# EAGLE design Control (EAGLE 9.6.2)
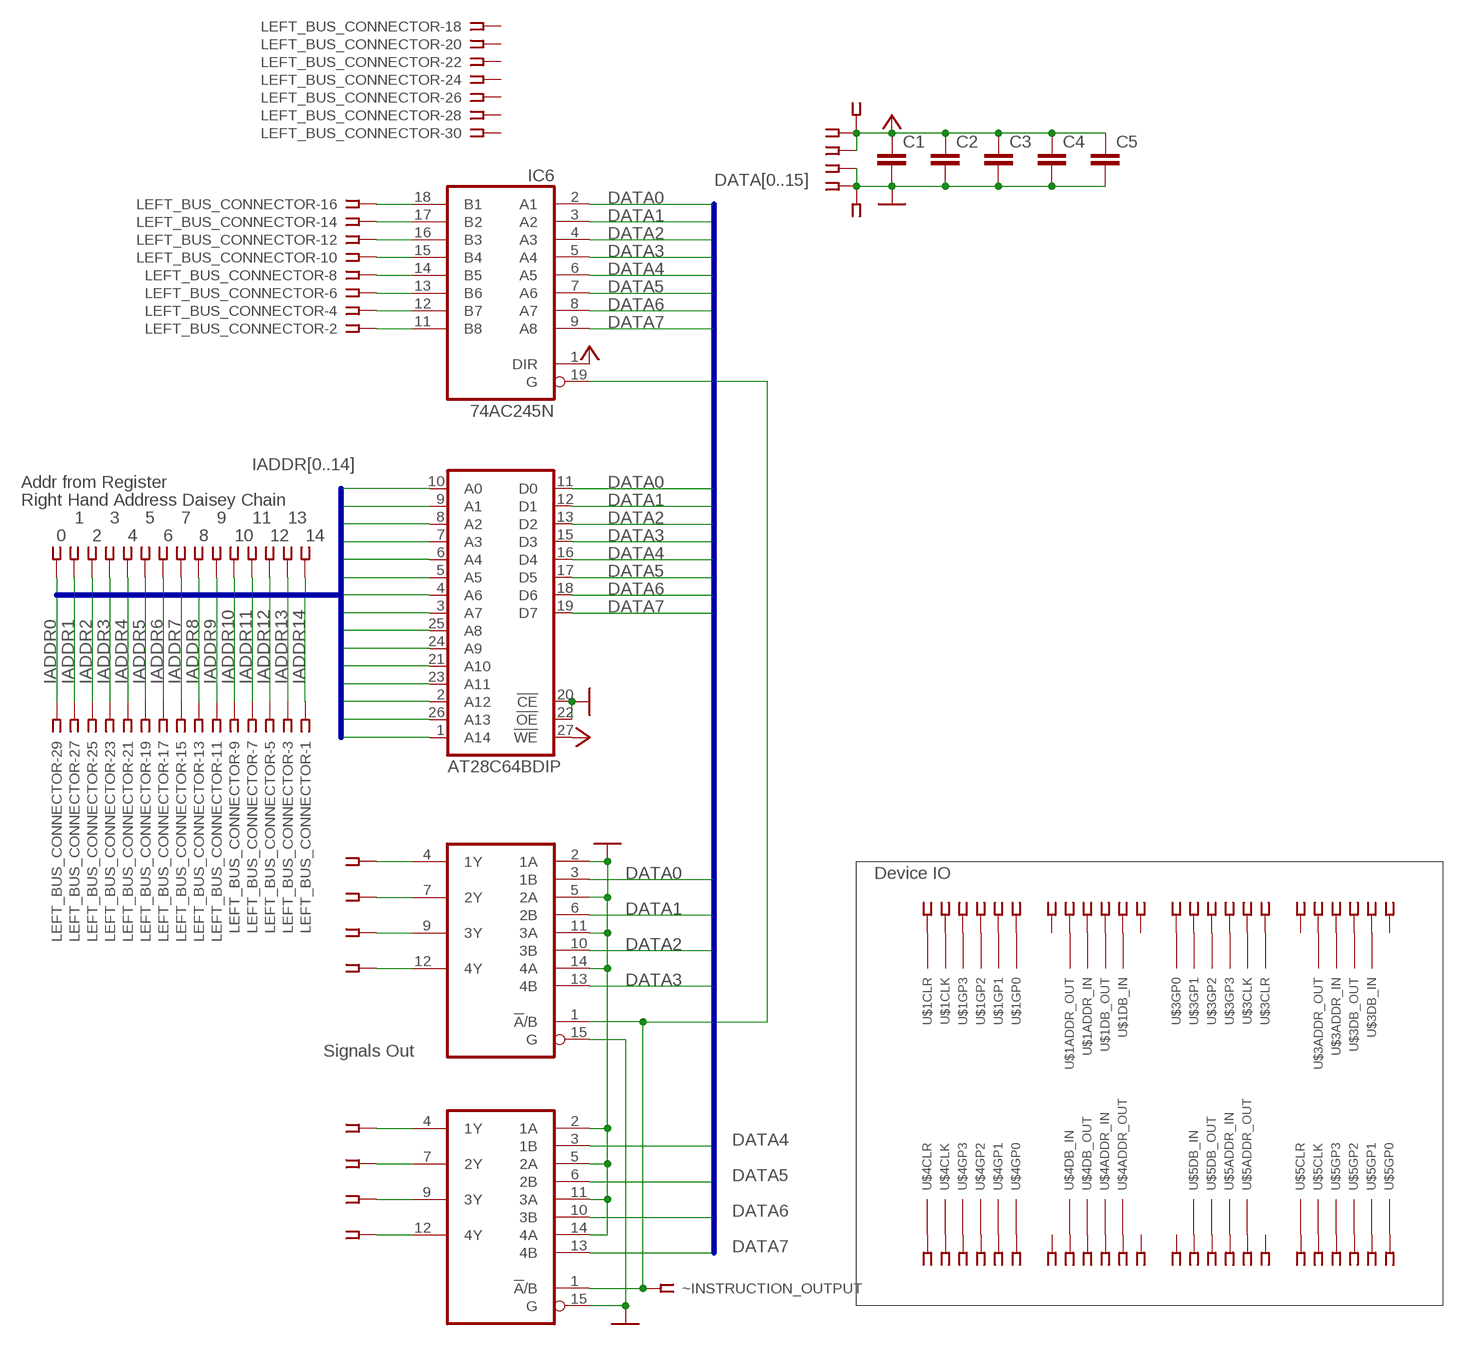
[diagram p0: schematic, sheet 1]

## Parts
C1  C2.5/2  [C2.5-2]
C2  C2.5/2  [C2.5-2]
C3  C2.5/2  [C2.5-2]
C4  C2.5/2  [C2.5-2]
C5  C2.5/2  [C2.5-2]
IC4  74AC157N  [DIL16]
IC5  74AC157N  [DIL16]
IC6  74AC245N  [DIL20]
LEFT_BUS_CONNECTOR  SSW-115-02-G-D  [SSW-115-02-G-D]
MEZZANINE  SSW-104-02-G-S  [SSW-104-02-G-S]
U$1  CONTROL_SIG-INT  [CONTROL_SIG-INT-FOOT]
U$2  AT28C64BDIP  [DIP28-WIDE]
U$3  CONTROL_SIG-INT  [CONTROL_SIG-INT-FOOT]
U$4  CONTROL_SIG-INT  [CONTROL_SIG-INT-FOOT]
U$5  CONTROL_SIG-INT  [CONTROL_SIG-INT-FOOT]
X1  SSW-106-02-G-S  [SSW-106-02-G-S]
X2  SSW-106-02-G-S  [SSW-106-02-G-S]
X3  SSW-106-02-G-S  [SSW-106-02-G-S]
X4  SSW-106-02-G-S  [SSW-106-02-G-S]
X5  SSW-108-02-G-S  [SSW-108-02-G-S]
X6  SSW-106-02-G-S  [SSW-106-02-G-S]
X7  SSW-106-02-G-S  [SSW-106-02-G-S]
X8  SSW-106-02-G-S  [SSW-106-02-G-S]
X9  SSW-106-02-G-S  [SSW-106-02-G-S]
X11  SSW-102-02-G-S  [SSW-102-02-G-S]
X12  SSW-115-02-G-S  [SSW-115-02-G-S]
~INSTRUCTION_OUTPUT  SSW-101-02-G-S  [SSW-101-02-G-S]

## Nets
DATA0: IC4.3(1B) IC6.2(A1) U$2.11(D0)
DATA1: IC4.6(2B) IC6.3(A2) U$2.12(D1)
DATA2: IC4.10(3B) IC6.4(A3) U$2.13(D2)
DATA3: IC4.13(4B) IC6.5(A4) U$2.15(D3)
DATA4: IC5.3(1B) IC6.6(A5) U$2.16(D4)
DATA5: IC5.6(2B) IC6.7(A6) U$2.17(D5)
DATA6: IC5.10(3B) IC6.8(A7) U$2.18(D6)
DATA7: IC5.13(4B) IC6.9(A8) U$2.19(D7)
GND: C1.2 C2.2 C3.2 C4.2 C5.2 IC4.2(1A) IC4.5(2A) IC4.11(3A) IC4.14(4A) IC4.15(G) IC5.2(1A) IC5.5(2A) IC5.11(3A) IC5.14(4A) IC5.15(G) MEZZANINE.3 MEZZANINE.4 U$2.20(!CE) U$2.22(!OE) X11.2
I_OUT: IC4.1(!A!/B) IC5.1(!A!/B) IC6.19(G) ~INSTRUCTION_OUTPUT.1
IADDR0: LEFT_BUS_CONNECTOR.29 U$2.10(A0) X12.1
IADDR1: LEFT_BUS_CONNECTOR.27 U$2.9(A1) X12.2
IADDR2: LEFT_BUS_CONNECTOR.25 U$2.8(A2) X12.3
IADDR3: LEFT_BUS_CONNECTOR.23 U$2.7(A3) X12.4
IADDR4: LEFT_BUS_CONNECTOR.21 U$2.6(A4) X12.5
IADDR5: LEFT_BUS_CONNECTOR.19 U$2.5(A5) X12.6
IADDR6: LEFT_BUS_CONNECTOR.17 U$2.4(A6) X12.7
IADDR7: LEFT_BUS_CONNECTOR.15 U$2.3(A7) X12.8
IADDR8: LEFT_BUS_CONNECTOR.13 U$2.25(A8) X12.9
IADDR9: LEFT_BUS_CONNECTOR.11 U$2.24(A9) X12.10
IADDR10: LEFT_BUS_CONNECTOR.9 U$2.21(A10) X12.11
IADDR11: LEFT_BUS_CONNECTOR.7 U$2.23(A11) X12.12
IADDR12: LEFT_BUS_CONNECTOR.5 U$2.2(A12) X12.13
IADDR13: LEFT_BUS_CONNECTOR.3 U$2.26(A13) X12.14
IADDR14: LEFT_BUS_CONNECTOR.1 U$2.1(A14) X12.15
N$1: U$1.GP0 X1.6
N$2: U$1.GP1 X1.5
N$3: U$1.GP2 X1.4
N$4: U$1.GP3 X1.3
N$5: U$1.CLK X1.2
N$6: U$1.CLR X1.1
N$7: U$1.DB_IN X2.2
N$8: U$1.DB_OUT X2.3
N$9: U$1.ADDR_IN X2.4
N$10: U$1.ADDR_OT X2.5
N$11: U$3.GP0 X3.6
N$12: U$3.GP1 X3.5
N$13: U$3.GP2 X3.4
N$14: U$3.GP3 X3.3
N$15: U$3.CLK X3.2
N$16: U$3.CLR X3.1
N$17: U$3.DB_IN X4.2
N$18: U$3.DB_OUT X4.3
N$19: U$3.ADDR_IN X4.4
N$20: U$3.ADDR_OT X4.5
N$21: U$4.CLR X9.1
N$22: U$4.CLK X9.2
N$23: U$4.GP0 X9.6
N$24: U$4.GP1 X9.5
N$25: U$4.GP2 X9.4
N$26: U$4.GP3 X9.3
N$27: U$4.DB_IN X8.2
N$28: U$4.DB_OUT X8.3
N$29: U$4.ADDR_IN X8.4
N$30: U$4.ADDR_OT X8.5
N$31: U$5.GP0 X6.6
N$32: U$5.GP3 X6.3
N$33: U$5.GP2 X6.4
N$34: U$5.GP1 X6.5
N$35: U$5.CLK X6.2
N$36: U$5.CLR X6.1
N$37: U$5.DB_IN X7.2
N$38: U$5.DB_OUT X7.3
N$39: U$5.ADDR_IN X7.4
N$40: U$5.ADDR_OT X7.5
O_DB0: IC6.18(B1) LEFT_BUS_CONNECTOR.16
O_DB1: IC6.17(B2) LEFT_BUS_CONNECTOR.14
O_DB2: IC6.16(B3) LEFT_BUS_CONNECTOR.12
O_DB3: IC6.15(B4) LEFT_BUS_CONNECTOR.10
O_DB4: IC6.14(B5) LEFT_BUS_CONNECTOR.8
O_DB5: IC6.13(B6) LEFT_BUS_CONNECTOR.6
O_DB6: IC6.12(B7) LEFT_BUS_CONNECTOR.4
O_DB7: IC6.11(B8) LEFT_BUS_CONNECTOR.2
SIG_1: IC4.4(1Y) X5.1
SIG_2: IC4.7(2Y) X5.2
SIG_3: IC4.9(3Y) X5.3
SIG_4: IC4.12(4Y) X5.4
SIG_5: IC5.4(1Y) X5.5
SIG_6: IC5.7(2Y) X5.6
SIG_7: IC5.9(3Y) X5.7
SIG_8: IC5.12(4Y) X5.8
VCC: C1.1 C2.1 C3.1 C4.1 C5.1 IC6.1(DIR) MEZZANINE.1 MEZZANINE.2 U$2.27(!WE) X11.1
Unconnected: LEFT_BUS_CONNECTOR.18 LEFT_BUS_CONNECTOR.20 LEFT_BUS_CONNECTOR.22 LEFT_BUS_CONNECTOR.24 LEFT_BUS_CONNECTOR.26 LEFT_BUS_CONNECTOR.28 LEFT_BUS_CONNECTOR.30 X2.1 X2.6 X4.1 X4.6 X7.1 X7.6 X8.1 X8.6

## Buses
IADDR[0..14]
DATA[0..15]

## Notes on the sheet
- Addr from Register
- Right Hand Address Daisey Chain
- 1 | 3 | 5 | 7 | 9 | 11 | 13
- 0 | 2 | 4 | 6 | 8 | 10 | 12 | 14
- Device IO
- Signals Out

## Power pins joined to a net without a drawn wire
GND: IC4.8(GND) IC5.8(GND) IC6.10(GND) U$1.GND U$2.14(GND) U$3.GND U$4.GND U$5.GND
VCC: IC4.16(VCC) IC5.16(VCC) IC6.20(VCC) U$1.VCC U$2.28(VCC) U$3.VCC U$4.VCC U$5.VCC

## Library data of the parts
C1-C5 = capacitor-wima:C: CAPACITOR naming: grid - package width
IC4 IC5 = 74xx-eu:74*157: Quadruple 2-line to 1-line data SELECTOR/MULTIPLEXER
IC6 = 74xx-eu:74*245: Octal BUS TRANSCEIVER, 3-state
LEFT_BUS_CONNECTOR = con-samtec:SSW-115-02-G: THROUGH-HOLE .025" SQ POST SOCKET Source: Samtec SSW.pdf; MF: Samtec Inc.; MPN: SSW-115-02-G-D; OC_FARNELL: unknown; OC_NEWARK: 11P9563
MEZZANINE = con-samtec:SSW-104-02-G-S: THROUGH-HOLE .025" SQ POST SOCKET Source: Samtec SSW.pdf; MF: Samtec Inc.; MPN: SSW-104-02-G-S; OC_FARNELL: unknown; OC_NEWARK: 11P9384
U$1 U$3-U$5 = Computer:CONTROL_SIG-INT
U$2 = Computer:AT28C64B
X1-X4 X6-X9 = con-samtec:SSW-106-02-G-S: THROUGH-HOLE .025" SQ POST SOCKET Source: Samtec SSW.pdf; MF: Samtec Inc.; MPN: SSW-106-02-G-S; OC_FARNELL: unknown; OC_NEWARK: 11P9416
X5 = con-samtec:SSW-108-02-G-S: THROUGH-HOLE .025" SQ POST SOCKET Source: Samtec SSW.pdf; MF: Samtec Inc.; MPN: SSW-108-02-G-S; OC_FARNELL: unknown; OC_NEWARK: 11P9448
X11 = con-samtec:SSW-102-02-G-S: THROUGH-HOLE .025" SQ POST SOCKET Source: Samtec SSW.pdf; MF: Samtec Inc.; MPN: SSW-102-02-G-S; OC_FARNELL: unknown; OC_NEWARK: 11P9351
X12 = con-samtec:SSW-115-02-G-S: THROUGH-HOLE .025" SQ POST SOCKET Source: Samtec SSW.pdf; MF: Samtec Inc.; MPN: SSW-115-02-G-S; OC_FARNELL: unknown; OC_NEWARK: 11P9564
~INSTRUCTION_OUTPUT = con-samtec:SSW-101-02-G-S: THROUGH-HOLE .025" SQ POST SOCKET Source: Samtec SSW.pdf; MF: Samtec Inc.; MPN: SSW-101-02-G-S; OC_FARNELL: unknown; OC_NEWARK: 11P9336

## Board
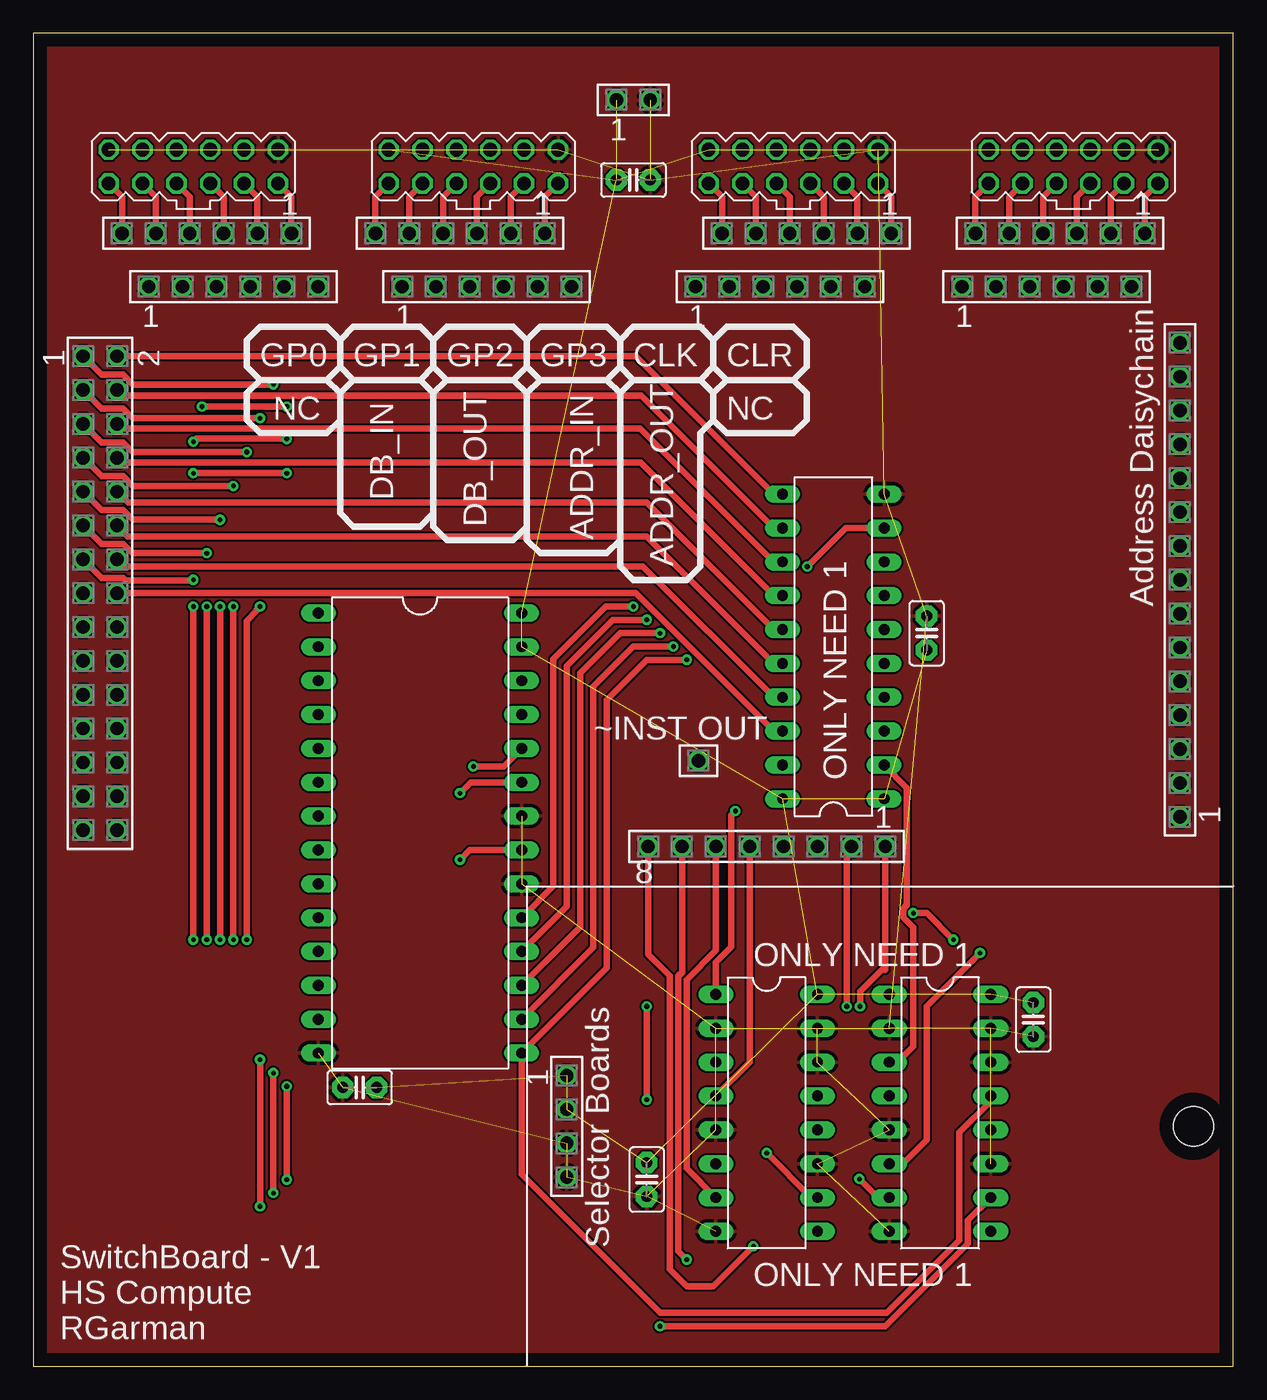
[diagram p1: board, top side]
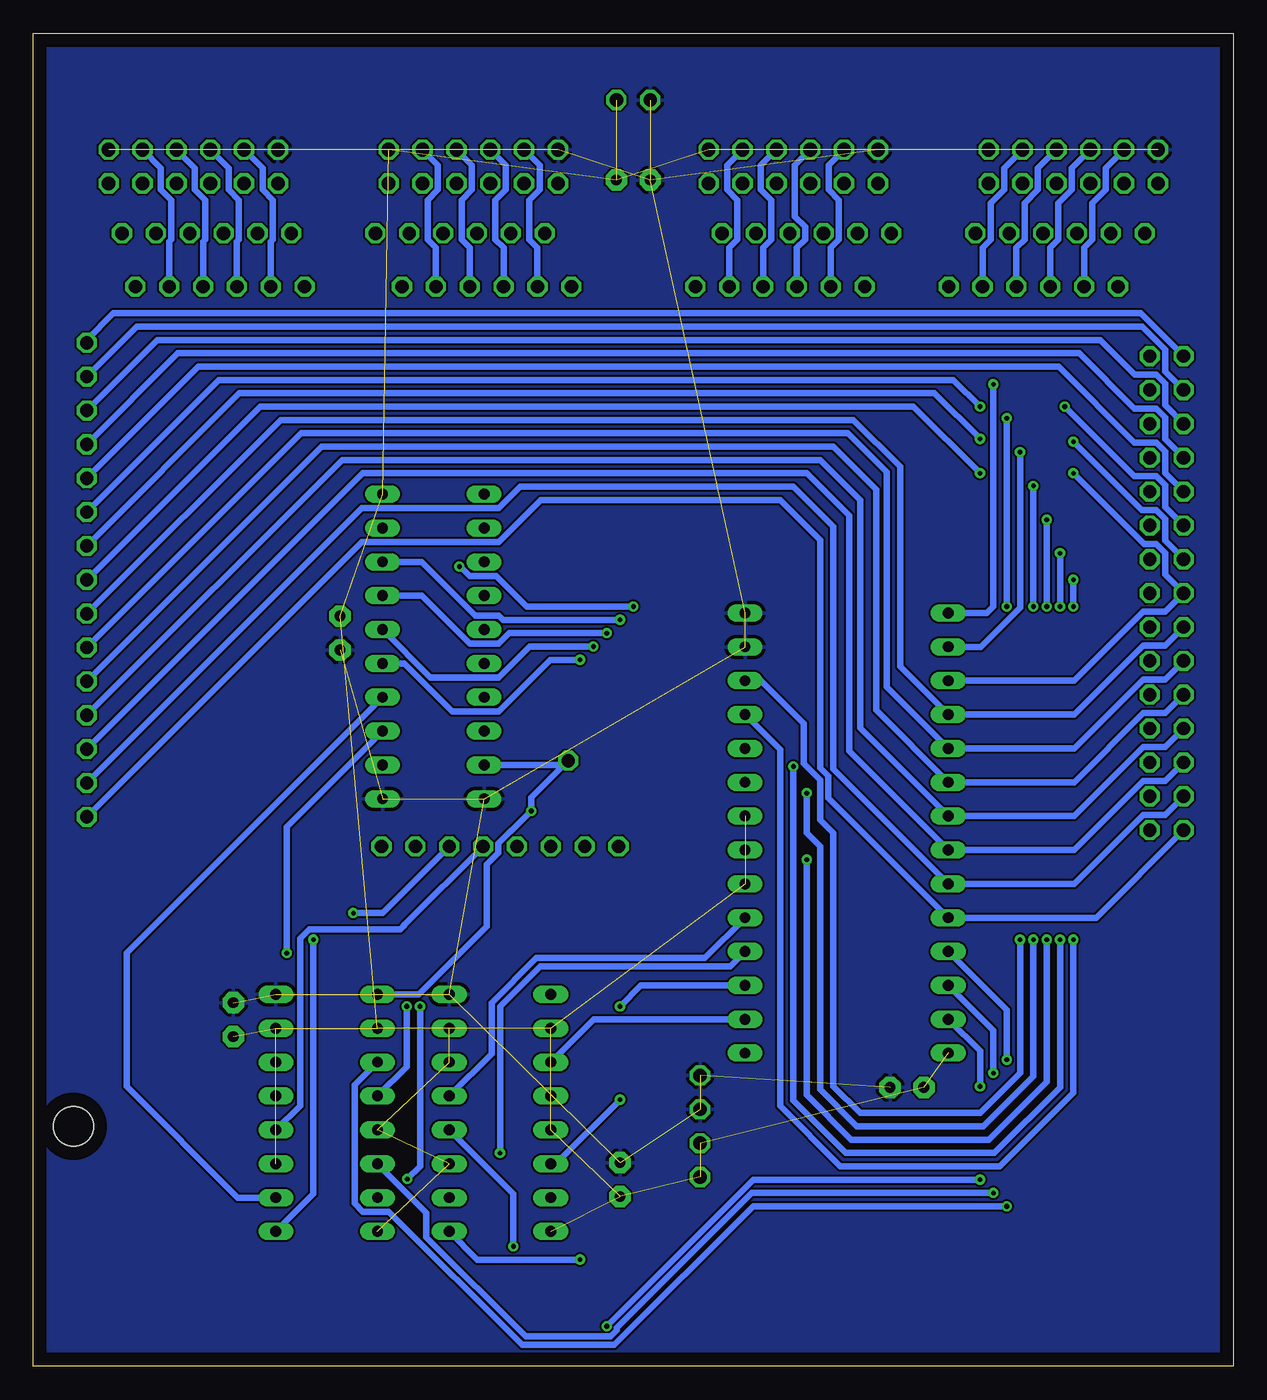
[diagram p2: board, bottom side, seen from below]

Size 90 x 100 mm. Coordinates in mm from the lower left corner, seen from the top.
Outline: 0,0 90,0 90,100 0,100 0,0
Copper layers (1*16): Top 0.035mm / dielectric 1.5mm / Bottom 0.035mm
Design rules "default *": minimum track width 19mil, minimum drill 0.35mm, track to track 6mil, track to pad 6mil, pad to pad 6mil, via to via 6mil, smd to smd 6mil, copper to edge 40mil, drill to drill 6mil, minimum pad ring 10mil, minimum via ring 8mil, stop-mask expansion 4mil, vias tented up to drill 0mil, thermal gap 10mil
Holes 3 mm at 87,18

### Footprints (pad centres in the part's own frame; a part is rotated, then mirrored left to right if it is on the bottom)
C2.5-2 = drill 0.813 pad 1.6 octagon: 1 -1.27,0; 2 1.27,0
DIL16 = drill 0.813 long: 1 -8.89,-3.81; 2 -6.35,-3.81; 3 -3.81,-3.81; 4 -1.27,-3.81; 5 1.27,-3.81; 6 3.81,-3.81; 7 6.35,-3.81; 8 8.89,-3.81; 9 8.89,3.81; 10 6.35,3.81; 11 3.81,3.81; 12 1.27,3.81; 13 -1.27,3.81; 14 -3.81,3.81; 15 -6.35,3.81; 16 -8.89,3.81
DIL20 = drill 0.813 long: 1 -11.43,-3.81; 2 -8.89,-3.81; 3 -6.35,-3.81; 4 -3.81,-3.81; 5 -1.27,-3.81; 6 1.27,-3.81; 7 3.81,-3.81; 8 6.35,-3.81; 9 8.89,-3.81; 10 11.43,-3.81; 11 11.43,3.81; 12 8.89,3.81; 13 6.35,3.81; 14 3.81,3.81; 15 1.27,3.81; 16 -1.27,3.81; 17 -3.81,3.81; 18 -6.35,3.81; 19 -8.89,3.81; 20 -11.43,3.81
SSW-115-02-G-D = drill 1 pad 1.5 octagon: 1 -17.78,-1.27; 2 -17.78,1.27; 3 -15.24,-1.27; 4 -15.24,1.27; 5 -12.7,-1.27; 6 -12.7,1.27; 7 -10.16,-1.27; 8 -10.16,1.27; 9 -7.62,-1.27; 10 -7.62,1.27; 11 -5.08,-1.27; 12 -5.08,1.27; 13 -2.54,-1.27; 14 -2.54,1.27; 15 0,-1.27; 16 0,1.27; 17 2.54,-1.27; 18 2.54,1.27; 19 5.08,-1.27; 20 5.08,1.27; 21 7.62,-1.27; 22 7.62,1.27; 23 10.16,-1.27; 24 10.16,1.27; 25 12.7,-1.27; 26 12.7,1.27; 27 15.24,-1.27; 28 15.24,1.27; 29 17.78,-1.27; 30 17.78,1.27
SSW-104-02-G-S = drill 1 pad 1.5 octagon: 1 -3.81,0; 2 -1.27,0; 3 1.27,0; 4 3.81,0
CONTROL_SIG-INT-FOOT = drill 1.016 octagon: ADDR_IN 1.27,1.27; ADDR_OT 3.81,1.27; CLK 3.81,-1.27; CLR 6.35,-1.27; DB_IN -3.81,1.27; DB_OUT -1.27,1.27; GND 6.35,1.27; GP0 -6.35,-1.27; GP1 -3.81,-1.27; GP2 -1.27,-1.27; GP3 1.27,-1.27; VCC -6.35,1.27
DIP28-WIDE = drill 0.813 long: 1 -16.51,-7.62; 2 -13.97,-7.62; 3 -11.43,-7.62; 4 -8.89,-7.62; 5 -6.35,-7.62; 6 -3.81,-7.62; 7 -1.27,-7.62; 8 1.27,-7.62; 9 3.81,-7.62; 10 6.35,-7.62; 11 8.89,-7.62; 12 11.43,-7.62; 13 13.97,-7.62; 14 16.51,-7.62; 15 16.51,7.62; 16 13.97,7.62; 17 11.43,7.62; 18 8.89,7.62; 19 6.35,7.62; 20 3.81,7.62; 21 1.27,7.62; 22 -1.27,7.62; 23 -3.81,7.62; 24 -6.35,7.62; 25 -8.89,7.62; 26 -11.43,7.62; 27 -13.97,7.62; 28 -16.51,7.62
SSW-106-02-G-S = drill 1 pad 1.5 octagon: 1 -6.35,0; 2 -3.81,0; 3 -1.27,0; 4 1.27,0; 5 3.81,0; 6 6.35,0
SSW-108-02-G-S = drill 1 pad 1.5 octagon: 1 -8.89,0; 2 -6.35,0; 3 -3.81,0; 4 -1.27,0; 5 1.27,0; 6 3.81,0; 7 6.35,0; 8 8.89,0
SSW-102-02-G-S = drill 1 pad 1.5 octagon: 1 -1.27,0; 2 1.27,0
SSW-115-02-G-S = drill 1 pad 1.5 octagon: 1 -17.78,0; 2 -15.24,0; 3 -12.7,0; 4 -10.16,0; 5 -7.62,0; 6 -5.08,0; 7 -2.54,0; 8 0,0; 9 2.54,0; 10 5.08,0; 11 7.62,0; 12 10.16,0; 13 12.7,0; 14 15.24,0; 15 17.78,0
SSW-101-02-G-S = drill 1 pad 1.5 octagon: 1 0,0

### Placement (x,y rotation side)
C1  67,55 90 top
C2  24.48,20.91 180 top
C3  45,89 0 top
C4  46,14 270 top
C5  75,26 270 top
IC4  68,19 270 top
IC5  55,19 270 top
IC6  60,54 90 top
LEFT_BUS_CONNECTOR  5,58 270 top
MEZZANINE  40,18 270 top
U$1  12,90 0 top
U$2  29,40 270 top
U$3  33,90 0 top
U$4  78,90 0 top
U$5  57,90 0 top
X1  13,85 180 top
X2  15,81 0 top
X3  32,85 180 top
X4  34,81 0 top
X5  55,39 180 top
X6  58,85 180 top
X7  56,81 0 top
X8  76,81 0 top
X9  77,85 180 top
X11  45,95 0 top
X12  86,59 90 top
~INSTRUCTION_OUTPUT  49.88,45.43 0 top

### Tracks (layer width: path | path; a pad name or v marks a point on that pad's centre or on a via)
DATA0  (via drill 0.35)
  Top 0.483: v17,23 v17,12 | IC6.2 65.53,43.4 65.53,34.62 65.23,34.32 65.23,33.68 66,32.91 66,24 64.81,22.81 IC4.3
  Bottom 0.483: U$2.11 17,26.73 v17,23 | v17,12 36.01,12 46.42,1.59 53.34,1.59 63.34,11.6 65.29,11.6 65.9,12.21 65.9,21.1 IC4.3
DATA1  (via drill 0.35)
  Top 0.483: v18,22 v18,13 | v71,31 67,27 67,17 65.19,15.19 IC4.6
  Bottom 0.483: U$2.12 18,25.19 v18,22 | IC4.6 60.52,11.52 60.52,9.67 53.08,2.23 46.68,2.23 46.23,2.68 46.23,2.87 36.1,13 v18,13 | IC6.3 71,40.46 v71,31
DATA2  (via drill 0.35)
  Top 0.483: v19,21 v19,14 | IC4.10 70.1,10.94 70.1,9.2 63.9,3 v47,3
  Bottom 0.483: U$2.13 19,23.65 v19,21 | v19,14 36,14 v47,3 | IC6.4 83,31 83,21 74.65,12.65 IC4.10
DATA3  (via drill 0.35)
  Top 0.483: IC4.13 71.81,19.88 69.46,17.53 69.46,9.46 64,4 47,4 36.62,14.38 U$2.15 43,29.87 43,50 46,53 v49,53
  Bottom 0.483: v49,53 51.23,53 55.09,49.14 58.57,49.14 62.17,52.73 IC6.5
DATA4  (via drill 0.35)
  Top 0.483: U$2.16 42,31.41 42,51 45,54 v48,54
  Bottom 0.483: IC5.3 47.97,26.03 U$2.16 | v48,54 52.77,54 55.09,51.68 60.22,51.68 IC6.6
DATA5  (via drill 0.35)
  Top 0.483: v46,20 v46,27 | U$2.17 41,32.95 41,52 44,55 v47,55
  Bottom 0.483: IC5.6 50.81,15.19 v46,20 | v46,27 44.43,28.57 U$2.17 | v47,55 54.31,55 55.09,54.22 57.29,54.22 60.88,57.81 IC6.7
DATA6  (via drill 0.35)
  Top 0.483: v55,16 58.35,12.65 IC5.10 | U$2.18 40,34.49 40,52.53 43.47,56 v46,56
  Bottom 0.483: U$2.18 37.73,30 52,30 55,27 v55,16 | IC6.8 60.88,60.35 56.85,56.32 55.09,56.32 54.77,56 v46,56
DATA7  (via drill 0.35)
  Top 0.483: U$2.19 39,36.03 39,53.07 42.93,57 v45,57 | v58.04,60 60.93,62.89 IC6.9
  Bottom 0.483: U$2.19 39.63,30.64 52.26,30.64 55.63,27.26 55.63,23.45 IC5.13 | v58.04,60 57.99,60 57.29,59.3 55.3,59.3 53,57 v45,57
GND  (27 unrouted)
  pour Top: 0,100 90,100 90,0 0,0
I_OUT  (via drill 0.35)
  Top 0.483: IC5.1 51.19,30.29 52.34,31.44 52.34,41.34 v52.66,41.66
  Bottom 0.483: IC4.1 61.11,27.89 56,33 56,37.65 55.12,38.52 55.12,39.23 54.2,40.15 54.16,40.15 v52.66,41.66 52.66,42.66 ~INSTRUCTION_OUTPUT.1 50.2,45.11 IC6.19
IADDR0
  Bottom 0.483: LEFT_BUS_CONNECTOR.29 10.3,33.65 U$2.10 30.36,42.63 30.36,44.26 31,44.9 31,62 34,65 51.93,65 55.09,61.84 65.38,61.84 X12.1
IADDR1
  Bottom 0.483: LEFT_BUS_CONNECTOR.27 5.12,41.37 6.75,41.37 11.92,36.19 U$2.9 30,44.81 30,63 33,66 53.47,66 55.09,64.38 65.38,64.38 X12.2
IADDR2
  Bottom 0.483: LEFT_BUS_CONNECTOR.25 5.12,43.91 6.75,43.91 11.92,38.73 U$2.8 28.82,46.17 28.82,63.83 32,67 65.3,67 X12.3
IADDR3
  Bottom 0.483: LEFT_BUS_CONNECTOR.23 5.12,46.45 6.75,46.45 11.92,41.27 U$2.7 28,47.89 28,65 31,68 66.84,68 X12.4
IADDR4
  Bottom 0.483: LEFT_BUS_CONNECTOR.21 5.12,48.99 6.75,48.99 11.92,43.81 U$2.6 26.79,49.22 26.79,65.78 30,69 68.38,69 X12.5
IADDR5
  Bottom 0.483: LEFT_BUS_CONNECTOR.19 5.12,51.53 6.75,51.53 11.92,46.35 U$2.5 26,50.97 26,67.07 28.93,70 69.92,70 X12.6
IADDR6
  Bottom 0.483: LEFT_BUS_CONNECTOR.17 5.12,54.07 6.75,54.07 11.92,48.89 U$2.4 25,52.51 25,67.48 28.52,71 71.46,71 X12.7
IADDR7  (via drill 0.35)
  Top 0.483: v12,67 v19,67
  Bottom 0.483: U$2.3 11.92,51.43 6.75,56.61 5.12,56.61 LEFT_BUS_CONNECTOR.15 5.12,59.39 5.12,61.02 5.79,61.69 6.69,61.69 v12,67 | v19,67 24,72 73,72 X12.8
IADDR8  (via drill 0.35)
  Top 0.483: LEFT_BUS_CONNECTOR.13 5.12,59.15 6.75,59.15 6.94,58.95 11.95,58.95 v12,59 | v12,69.35 12.22,69.58 v19,69.58 | v12,32 v12,57
  Bottom 0.483: U$2.25 34,46.27 34,19.52 29.48,15 17.52,15 12,20.52 v12,32 | v12,57 v12,59 | LEFT_BUS_CONNECTOR.13 5.12,61.93 5.12,63.55 5.79,64.23 6.87,64.23 v12,69.35 | v19,69.58 22.42,73 74.54,73 X12.9
IADDR9  (via drill 0.35)
  Top 0.483: v13,32 v13,57 | U$2.24 35.27,45 v33,45 | v13,61 7.43,61 6.75,61.69 5.12,61.69 LEFT_BUS_CONNECTOR.11 | v12.65,72 v19,72
  Bottom 0.483: v13,32 13,20.93 17.93,16 29.07,16 33,19.93 v33,45 | v13,57 v13,61 | LEFT_BUS_CONNECTOR.11 5.12,64.47 5.12,66.09 5.79,66.77 7.42,66.77 v12.65,72 | v19,72 21,74 76.08,74 X12.10
IADDR10  (via drill 0.35)
  Top 0.483: U$2.21 32.73,38.73 v32,38 | v14,32 v14,57 | LEFT_BUS_CONNECTOR.9 5.12,64.23 6.75,64.23 7.47,63.5 v14,63.5
  Bottom 0.483: v14,32 14,21.34 18.34,17 28.66,17 32,20.34 v32,38 | LEFT_BUS_CONNECTOR.9 5.12,67.01 5.12,68.64 5.79,69.31 7.42,69.31 13.11,75 77.62,75 X12.11 | v14,57 v14,63.5
IADDR11  (via drill 0.35)
  Top 0.483: v15,32 v15,57 | U$2.23 32.81,43.81 v32,43 | v15,66.04 7.47,66.04 6.75,66.77 5.12,66.77 LEFT_BUS_CONNECTOR.7
  Bottom 0.483: v15,32 15,21.76 18.76,18 28.24,18 31,20.76 31,39 32,40 v32,43 | v15,57 v15,66.04 | LEFT_BUS_CONNECTOR.7 5.12,69.55 5.12,71.17 5.79,71.85 7.42,71.85 11.57,76 40,76 40.47,76 79.16,76 X12.12
IADDR12  (via drill 0.35)
  Top 0.483: LEFT_BUS_CONNECTOR.5 5.12,69.31 6.75,69.31 7.47,68.58 v16,68.58
  Bottom 0.483: U$2.2 18.94,53.97 16,56.91 v16,68.58 | LEFT_BUS_CONNECTOR.5 5.12,72.09 5.12,73.72 5.79,74.39 7.39,74.39 10,77 80.7,77 X12.13
IADDR13  (via drill 0.35)
  Top 0.483: v17,57 16.77,56.77 16.77,56.68 16,55.91 v16,32 | v17,71.12 7.47,71.12 6.75,71.85 5.12,71.85 LEFT_BUS_CONNECTOR.3
  Bottom 0.483: U$2.26 35.43,51.43 32.23,48.23 32.23,45.23 31,44 31,41 30,40 30,21 28,19 19,19 16,22 v16,32 | X12.14 82.26,77.98 6.85,77.98 5.12,76.25 5.12,74.63 LEFT_BUS_CONNECTOR.3 | v17,57 v17,71.12
IADDR14  (via drill 0.35)
  Top 0.483: LEFT_BUS_CONNECTOR.1 5.12,74.39 6.75,74.39 7.47,73.66 v18,73.66
  Bottom 0.483: U$2.1 18.49,56.51 18,57 v18,73.66 | LEFT_BUS_CONNECTOR.1 6.95,79 84,79 86,77 X12.15
N$1
  Top 0.483: U$1.GP0 6.65,87.73 X1.6
N$2
  Top 0.483: U$1.GP1 9.19,87.73 X1.5
N$3
  Top 0.483: U$1.GP2 11.73,87.73 X1.4
N$4
  Top 0.483: U$1.GP3 14.27,87.73 X1.3
N$5
  Top 0.483: U$1.CLK 16.81,87.73 X1.2
N$6
  Top 0.483: U$1.CLR 19.35,87.73 X1.1
N$7
  Bottom 0.483: X2.2 11.19,83.92 10.58,84.53 10.58,87.24 9.57,88.25 9.57,89.89 U$1.DB_IN
N$8
  Bottom 0.483: X2.3 13.73,83.92 13.12,84.53 13.12,87.24 12.11,88.25 12.11,89.89 U$1.DB_OUT
N$9
  Bottom 0.483: X2.4 16.27,83.92 15.66,84.53 15.66,87.24 14.65,88.25 14.65,89.89 U$1.ADDR_IN
N$10
  Bottom 0.483: X2.5 18.81,83.92 18.2,84.53 18.2,87.24 17.19,88.25 17.19,89.89 U$1.ADDR_OT
N$11
  Top 0.483: U$3.GP0 25.65,87.73 X3.6
N$12
  Top 0.483: U$3.GP1 28.19,87.73 X3.5
N$13
  Top 0.483: U$3.GP2 30.73,87.73 X3.4
N$14
  Top 0.483: U$3.GP3 33.27,87.73 X3.3
N$15
  Top 0.483: U$3.CLK 35.81,87.73 X3.2
N$16
  Top 0.483: U$3.CLR 38.35,87.73 X3.1
N$17
  Bottom 0.483: X4.2 30.19,83.92 29.58,84.53 29.58,87.49 30.35,88.25 30.35,90.11 U$3.DB_IN
N$18
  Bottom 0.483: X4.3 32.73,83.92 32.12,84.53 32.12,85.47 32.89,86.24 32.89,90.11 U$3.DB_OUT
N$19
  Bottom 0.483: X4.4 35.27,83.92 34.66,84.53 34.66,87.49 35.43,88.25 35.43,90.11 U$3.ADDR_IN
N$20
  Bottom 0.483: X4.5 37.81,83.92 37.2,84.53 37.2,87.49 37.97,88.25 37.97,90.11 U$3.ADDR_OT
N$21
  Top 0.483: U$4.CLR 83.35,87.73 X9.1
N$22
  Top 0.483: U$4.CLK 80.81,87.73 X9.2
N$23
  Top 0.483: U$4.GP0 70.65,87.73 X9.6
N$24
  Top 0.483: U$4.GP1 73.19,87.73 X9.5
N$25
  Top 0.483: U$4.GP2 75.73,87.73 X9.4
N$26
  Top 0.483: U$4.GP3 78.27,87.73 X9.3
N$27
  Bottom 0.483: X8.2 72.19,84.38 72.04,84.53 72.04,87.49 72.81,88.25 72.81,89.89 U$4.DB_IN
N$28
  Bottom 0.483: X8.3 74.73,84.38 74.58,84.53 74.58,87.49 75.35,88.25 75.35,89.89 U$4.DB_OUT
N$29
  Bottom 0.483: X8.4 77.27,84.38 77.12,84.53 77.12,87.49 77.89,88.25 77.89,89.89 U$4.ADDR_IN
N$30
  Bottom 0.483: X8.5 79.81,84.38 79.66,84.53 79.66,87.49 80.43,88.25 80.43,89.89 U$4.ADDR_OT
N$31
  Top 0.483: U$5.GP0 51.65,87.73 X6.6
N$32
  Top 0.483: U$5.GP3 59.27,87.73 X6.3
N$33
  Top 0.483: U$5.GP2 56.73,87.73 X6.4
N$34
  Top 0.483: U$5.GP1 54.19,87.73 X6.5
N$35
  Top 0.483: U$5.CLK 61.81,87.73 X6.2
N$36
  Top 0.483: U$5.CLR 64.35,87.73 X6.1
N$37
  Bottom 0.483: X7.2 52.19,83.92 52.8,84.53 52.8,87.49 52.03,88.25 52.03,90.11 U$5.DB_IN
N$38
  Bottom 0.483: X7.3 54.73,83.92 55.34,84.53 55.34,87.49 54.57,88.25 54.57,90.11 U$5.DB_OUT
N$39
  Bottom 0.483: X7.4 57.27,83.92 57.88,84.53 57.88,87.49 57.11,88.25 57.11,90.11 U$5.ADDR_IN
N$40
  Bottom 0.483: X7.5 59.81,83.92 60.42,84.53 60.42,87.49 59.65,88.25 59.65,90.11 U$5.ADDR_OT
O_DB0
  Top 0.483: LEFT_BUS_CONNECTOR.16 45.18,58 55.53,47.65 IC6.18
O_DB1
  Top 0.483: LEFT_BUS_CONNECTOR.14 6.81,60 45.72,60 55.53,50.19 IC6.17
O_DB2
  Top 0.483: LEFT_BUS_CONNECTOR.12 7.1,62.25 46.01,62.25 55.53,52.73 IC6.16
O_DB3
  Top 0.483: LEFT_BUS_CONNECTOR.10 7.11,64.78 46.02,64.78 55.53,55.27 IC6.15
O_DB4
  Top 0.483: LEFT_BUS_CONNECTOR.8 6.64,67.79 45.55,67.79 55.53,57.81 IC6.14
O_DB5
  Top 0.483: LEFT_BUS_CONNECTOR.6 6.62,70.35 45.53,70.35 55.53,60.35 IC6.13
O_DB6
  Top 0.483: LEFT_BUS_CONNECTOR.4 6.68,72.83 45.59,72.83 55.53,62.89 IC6.12
O_DB7
  Top 0.483: LEFT_BUS_CONNECTOR.2 45.18,75.78 55.53,65.43 IC6.11
SIG_1  (via drill 0.35)
  Top 0.483: X5.1 63.89,30 | 63.89,29.74 63.89,30 | 63.89,30 62,28.11 v62,27
  Bottom 0.483: v62,27 62,22.46 IC4.4
SIG_2  (via drill 0.35)
  Top 0.483: X5.2 61,38.65 v61,27 | v61.95,14.05 63.35,12.65 IC4.7
  Bottom 0.483: v61,27 61,15 v61.95,14.05
SIG_3  (via drill 0.35)
  Top 0.483: v69,32 67,34 v66,34
  Bottom 0.483: X5.3 63.81,34 v66,34 | IC4.9 69,12.92 v69,32
SIG_4
  Bottom 0.483: X5.4 62.13,33.13 62.27,33 62.5,32.77 69.32,32.77 70,32.09 70,19.54 IC4.12
SIG_5
  Top 0.483: X5.5 53.73,22.81 IC5.4
SIG_6
  Top 0.483: X5.6 51.19,31.19 49,29 49,14.84 IC5.7
SIG_7  (via drill 0.35)
  Top 0.483: X5.7 48.65,29.55 48.37,29.26 48.37,8.63 v49,8
  Bottom 0.483: v49,8 56.7,8 IC5.9
SIG_8  (via drill 0.35)
  Top 0.483: X5.8 46.11,30.89 47.73,29.27 47.73,7.27 49,6 51,6 v54,9
  Bottom 0.483: v54,9 54,12.92 IC5.12
VCC  (17 unrouted)
  pour Bottom: 0,100 90,100 90,0 0,0

### Text on the board
tPlace: 8 | Selector Boards
tNames: GP0 | GP1 | GP2 | GP3 | CLK | CLR | NC | NC | DB_IN | DB_OUT | ADDR_IN | ADDR_OUT | Address Daisychain | ~INST OUT | ONLY NEED 1 | ONLY NEED 1 | ONLY NEED 1 | SwitchBoard - V1 / HS Compute / RGarman
tValues: Instruction Output